# Altium schematic sheet MyProSch1.SchDoc: LPC1769
size A; DrawnBy: Castro Germán; Revision: R00
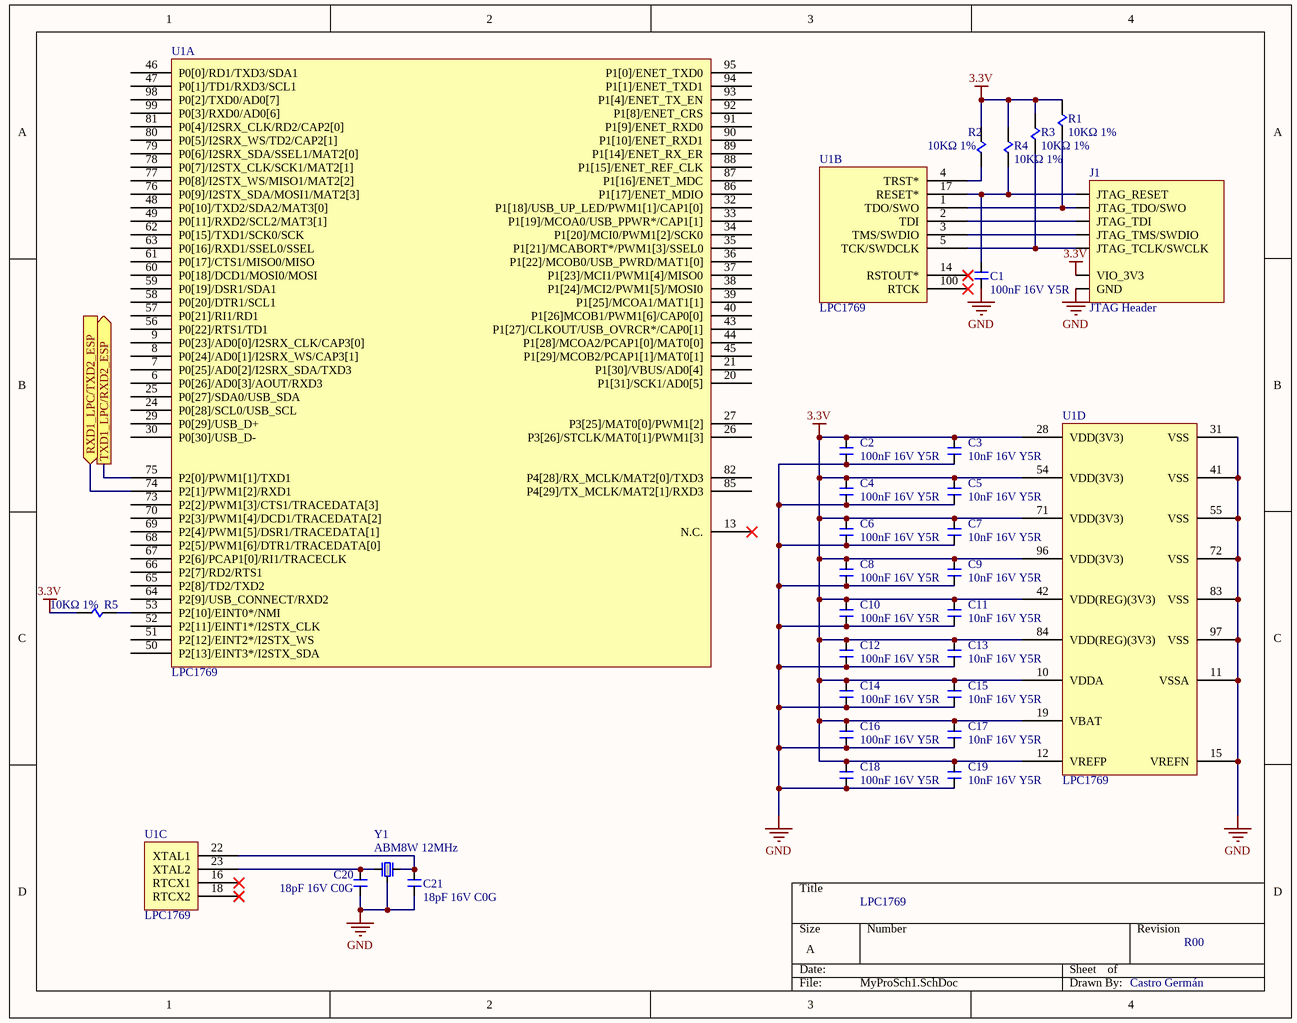
[diagram p0: MyProSch1.SchDoc]

## Parts
C1  100nF 16V Y5R  [C_0805]
C2  100nF 16V Y5R  [C_0805]
C3  10nF 16V Y5R  [C_0805]
C4  100nF 16V Y5R  [C_0805]
C5  10nF 16V Y5R  [C_0805]
C6  100nF 16V Y5R  [C_0805]
C7  10nF 16V Y5R  [C_0805]
C8  100nF 16V Y5R  [C_0805]
C9  10nF 16V Y5R  [C_0805]
C10  100nF 16V Y5R  [C_0805]
C11  10nF 16V Y5R  [C_0805]
C12  100nF 16V Y5R  [C_0805]
C13  10nF 16V Y5R  [C_0805]
C14  100nF 16V Y5R  [C_0805]
C15  10nF 16V Y5R  [C_0805]
C16  100nF 16V Y5R  [C_0805]
C17  10nF 16V Y5R  [C_0805]
C18  100nF 16V Y5R  [C_0805]
C19  10nF 16V Y5R  [C_0805]
C20  18pF 16V C0G  [C_0805]
C21  18pF 16V C0G  [C_0805]
J1  JTAG Header
R1  10KΩ 1%  [R_0805]
R2  10KΩ 1%  [R_0805]
R3  10KΩ 1%  [R_0805]
R4  10KΩ 1%  [R_0805]
R5  10KΩ 1%  [R_0805]
U1  LPC1769  [LQFP100]  (parts A,B,C,D of 4)
Y1  ABM8W 12MHz  [ABM8W]

## Ports
RXD1_LPC/TXD2_ESP (in), TXD1_LPC/RXD2_ESP (out)

## Nets
3.3V: C2.1(A1) C3.1(A1) C4.1(A1) C5.1(A1) C6.1(A1) C7.1(A1) C8.1(A1) C9.1(A1) C10.1(A1) C11.1(A1) C12.1(A1) C13.1(A1) C14.1(A1) C15.1(A1) C16.1(A1) C17.1(A1) C18.1(A1) C19.1(A1) J1.1(VIO_3V3) R1.2(P2) R2.2(P2) R3.2(P2) R4.2(P2) R5.1(P1) U1.10(VDDA) U1.12(VREFP) U1.19(VBAT) U1.28(VDD(3V3)) U1.42(VDD(REG)(3V3)) U1.54(VDD(3V3)) U1.71(VDD(3V3)) U1.84(VDD(REG)(3V3)) U1.96(VDD(3V3))
GND: C1.2(A2) C2.2(A2) C3.2(A2) C4.2(A2) C5.2(A2) C6.2(A2) C7.2(A2) C8.2(A2) C9.2(A2) C10.2(A2) C11.2(A2) C12.2(A2) C13.2(A2) C14.2(A2) C15.2(A2) C16.2(A2) C17.2(A2) C18.2(A2) C19.2(A2) C20.2(A2) C21.2(A2) J1.8(GND) U1.11(VSSA) U1.15(VREFN) U1.31(VSS) U1.41(VSS) U1.55(VSS) U1.72(VSS) U1.83(VSS) U1.97(VSS) Y1.3(P3)
RXD1_LPC/TXD2_ESP: U1.74(P2[1]/PWM1[2]/RXD1) ; port RXD1_LPC/TXD2_ESP
TXD1_LPC/RXD2_ESP: U1.75(P2[0]/PWM1[1]/TXD1) ; port TXD1_LPC/RXD2_ESP
NetC1_1: C1.1(A1) J1.6(JTAG_RESET) R4.1(P1) U1.17(RESET*)
NetC20_1: C20.1(A1) U1.23(XTAL2) Y1.1(P1)
NetC21_1: C21.1(A1) U1.22(XTAL1) Y1.2(P2)
NetJ1_2: J1.2(JTAG_TMS/SWDIO) U1.3(TMS/SWDIO)
NetJ1_3: J1.3(JTAG_TCLK/SWCLK) R3.1(P1) U1.5(TCK/SWDCLK)
NetJ1_4: J1.4(JTAG_TDO/SWO) R1.1(P1) U1.1(TDO/SWO)
NetJ1_5: J1.5(JTAG_TDI) U1.2(TDI)
NetR2_1: R2.1(P1) U1.4(TRST*)
NetR5_2: R5.2(P2) U1.53(P2[10]/EINT0*/NMI)

Not connected (* = marked no-connect by the designer): U1 6(P0[26]/AD0[3]/AOUT/RXD3) 7(P0[25]/AD0[2]/I2SRX_SDA/TXD3) 8(P0[24]/AD0[1]/I2SRX_WS/CAP3[1]) 9(P0[23]/AD0[0]/I2SRX_CLK/CAP3[0]) 13(N.C.)* 14(RSTOUT*)* 16(RTCX1)* 18(RTCX2)* 20(P1[31]/SCK1/AD0[5]) 21(P1[30]/VBUS/AD0[4]) 24(P0[28]/SCL0/USB_SCL) 25(P0[27]/SDA0/USB_SDA) 26(P3[26]/STCLK/MAT0[1]/PWM1[3]) 27(P3[25]/MAT0[0]/PWM1[2]) 29(P0[29]/USB_D+) 30(P0[30]/USB_D-) 32(P1[18]/USB_UP_LED/PWM1[1]/CAP1[0]) 33(P1[19]/MCOA0/USB_PPWR*/CAP1[1]) 34(P1[20]/MCI0/PWM1[2]/SCK0) 35(P1[21]/MCABORT*/PWM1[3]/SSEL0) 36(P1[22]/MCOB0/USB_PWRD/MAT1[0]) 37(P1[23]/MCI1/PWM1[4]/MISO0) 38(P1[24]/MCI2/PWM1[5]/MOSI0) 39(P1[25]/MCOA1/MAT1[1]) 40(P1[26]MCOB1/PWM1[6]/CAP0[0]) 43(P1[27]/CLKOUT/USB_OVRCR*/CAP0[1]) 44(P1[28]/MCOA2/PCAP1[0]/MAT0[0]) 45(P1[29]/MCOB2/PCAP1[1]/MAT0[1]) 46(P0[0]/RD1/TXD3/SDA1) 47(P0[1]/TD1/RXD3/SCL1) 48(P0[10]/TXD2/SDA2/MAT3[0]) 49(P0[11]/RXD2/SCL2/MAT3[1]) 50(P2[13]/EINT3*/I2STX_SDA) 51(P2[12]/EINT2*/I2STX_WS) 52(P2[11]/EINT1*/I2STX_CLK) 56(P0[22]/RTS1/TD1) 57(P0[21]/RI1/RD1) 58(P0[20]/DTR1/SCL1) 59(P0[19]/DSR1/SDA1) 60(P0[18]/DCD1/MOSI0/MOSI) 61(P0[17]/CTS1/MISO0/MISO) 62(P0[15]/TXD1/SCK0/SCK) 63(P0[16]/RXD1/SSEL0/SSEL) 64(P2[9]/USB_CONNECT/RXD2) 65(P2[8]/TD2/TXD2) 66(P2[7]/RD2/RTS1) 67(P2[6]/PCAP1[0]/RI1/TRACECLK) 68(P2[5]/PWM1[6]/DTR1/TRACEDATA[0]) 69(P2[4]/PWM1[5]/DSR1/TRACEDATA[1]) 70(P2[3]/PWM1[4]/DCD1/TRACEDATA[2]) 73(P2[2]/PWM1[3]/CTS1/TRACEDATA[3]) 76(P0[9]/I2STX_SDA/MOSI1/MAT2[3]) 77(P0[8]/I2STX_WS/MISO1/MAT2[2]) 78(P0[7]/I2STX_CLK/SCK1/MAT2[1]) 79(P0[6]/I2SRX_SDA/SSEL1/MAT2[0]) 80(P0[5]/I2SRX_WS/TD2/CAP2[1]) 81(P0[4]/I2SRX_CLK/RD2/CAP2[0]) 82(P4[28]/RX_MCLK/MAT2[0]/TXD3) 85(P4[29]/TX_MCLK/MAT2[1]/RXD3) 86(P1[17]/ENET_MDIO) 87(P1[16]/ENET_MDC) 88(P1[15]/ENET_REF_CLK) 89(P1[14]/ENET_RX_ER) 90(P1[10]/ENET_RXD1) 91(P1[9]/ENET_RXD0) 92(P1[8]/ENET_CRS) 93(P1[4]/ENET_TX_EN) 94(P1[1]/ENET_TXD1) 95(P1[0]/ENET_TXD0) 98(P0[2]/TXD0/AD0[7]) 99(P0[3]/RXD0/AD0[6]) 100(RTCK)*

## Library data of the parts
C1-C21 = Capacitor
R1-R5 = Resistor
U1 = LPC1769: 32 bit ARM Cortex M3
Y1 = Crystal